# EAGLE design HD44780_to_1.8TFT_adapter.v1 (EAGLE 5.07)
LICENSE: CC-0; PROJECT: HD44780 to 1.8" TFT LCD Adapter
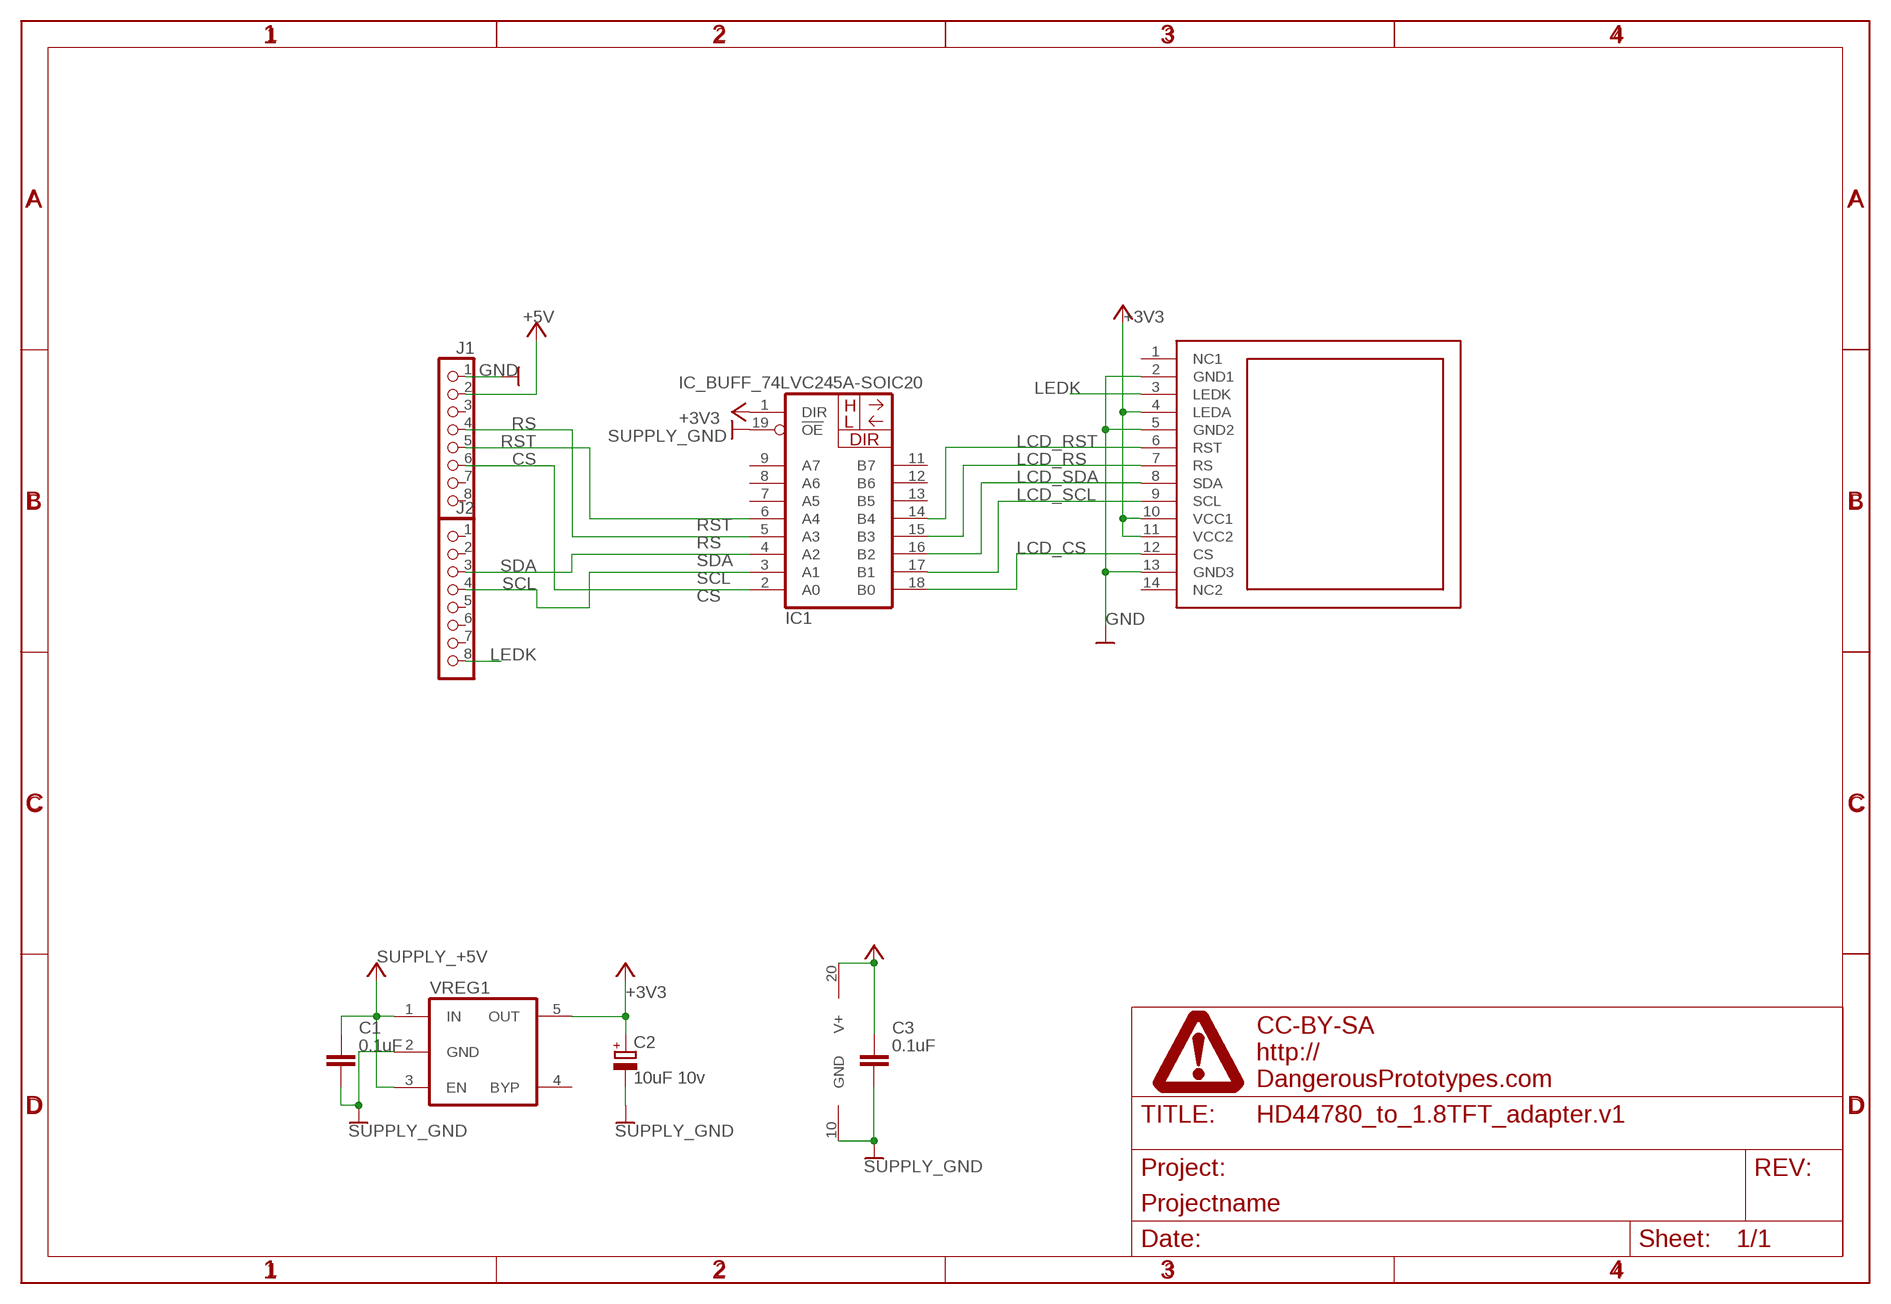
[diagram p0: schematic, sheet 1]

## Parts
C1  0.1uF  CAPACITOR_NPOL-0603  [C603]
C2  10uF 10v  CAPACITOR_POL-SMC_A  [SMC_A]
C3  0.1uF  CAPACITOR_NPOL-0603  [C603]
IC1  IC_BUFF_74LVC245A-SOIC20  [SOIC-20]
J1  CON_HEADER_1X08-PTH  [M1X8]
J2  CON_HEADER_1X08-PTH  [M1X8]
U$1  FRAME_DINA4_L  [DP_LOGO]
U$2  DISP_TFT18  [TFT18]
VREG1  VREG_5PINS-SOT-23-5  [SOT-23-5]

## Nets
+3V3: C2.+ C3.1 IC1.1(DIR) IC1.20(V+) U$2.4(LEDA) U$2.10(VCC1) U$2.11(VCC2) VREG1.5(OUT) ; supply symbol labelled SUPPLY_+3V3
+5V: C1.1 J1.2 VREG1.1(IN) VREG1.3(EN) ; supply symbol labelled SUPPLY_+5V
CS: IC1.2(A0) J1.6
GND: C1.2 C2.- C3.2 IC1.10(GND) IC1.19(!OE) J1.1 U$2.2(GND1) U$2.5(GND2) U$2.13(GND3) VREG1.2(GND) ; supply symbol labelled SUPPLY_GND
LCD_CS: IC1.18(B0) U$2.12(CS)
LCD_RS: IC1.15(B3) U$2.7(RS)
LCD_RST: IC1.14(B4) U$2.6(RST)
LCD_SCL: IC1.17(B1) U$2.9(SCL)
LCD_SDA: IC1.16(B2) U$2.8(SDA)
LEDK: J2.8 U$2.3(LEDK)
RS: IC1.5(A3) J1.4
RST: IC1.6(A4) J1.5
SCL: IC1.3(A1) J2.4
SDA: IC1.4(A2) J2.3
Unconnected: IC1.7(A5) IC1.8(A6) IC1.9(A7) IC1.11(B7) IC1.12(B6) IC1.13(B5) J1.3 J1.7 J1.8 J2.1 J2.2 J2.5 J2.6 J2.7 U$2.1(NC1) U$2.14(NC2) VREG1.4(BYP)

## Library data of the parts
C1 C3 = dp_devices:CAPACITOR_NPOL: Non-Polarized capacitor in various packages
C2 = dp_devices:CAPACITOR_POL: Polarized capacitor in various packages
IC1 = dp_devices:IC_BUFF_74LVC245A: Octal Bus transceiver with 3-state, 3.3V supply
J1 J2 = dp_devices:CON_HEADER_1X08
U$1 = dp_devices:FRAME_DINA4_L: A4 DP frame Standard Dangerous Prototypes schematic frame. Automagically adds the DP logo and standard texts to the PCB Use the atrribute in the schematic editor to change the fields.; FF1: fulfillment by; FF2: Seeed Studio; FF3: www.seeedstudio.com; LICENSE: CC-BY-SA; PROJECT: Projectname; URL1: http://; URL2: DangerousPrototypes.com
U$2 = dp_devices:DISP_TFT18
VREG1 = dp_devices:VREG_5PINS: 5 pins voltage regulator

## Board
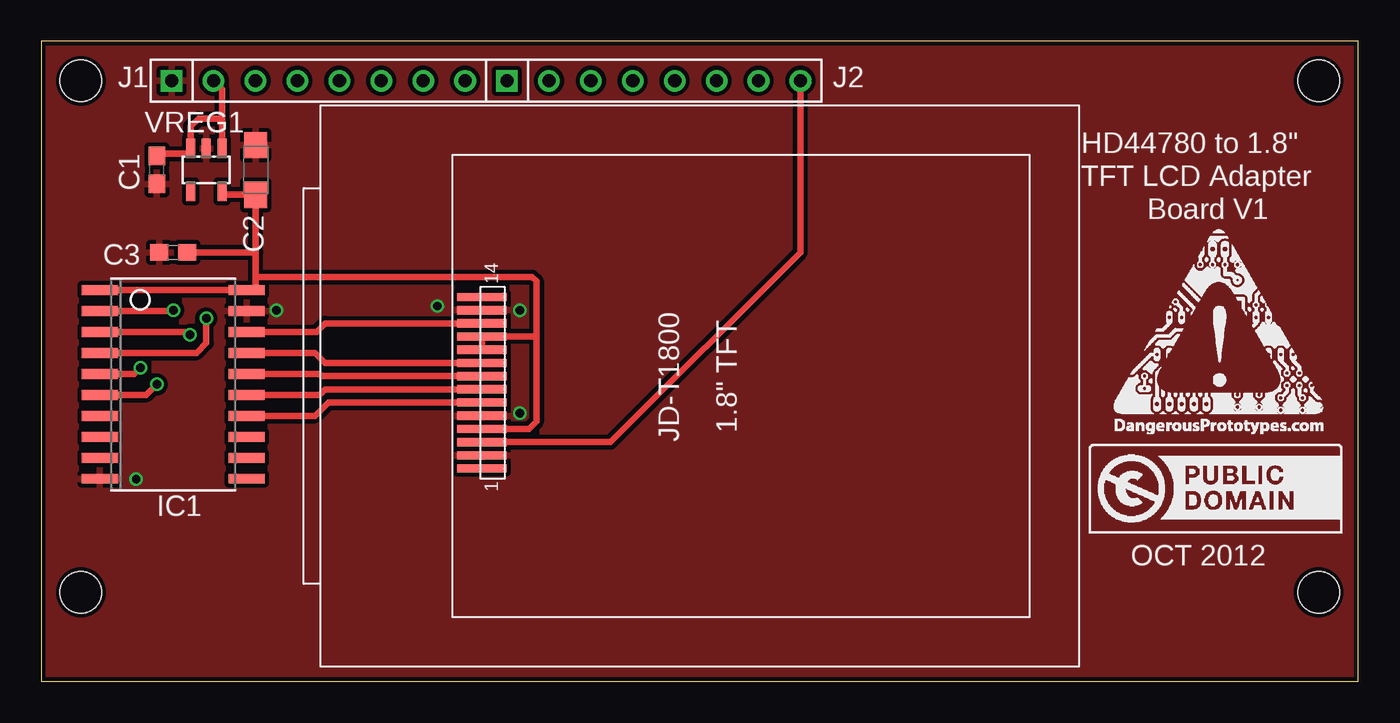
[diagram p1: board, top side]
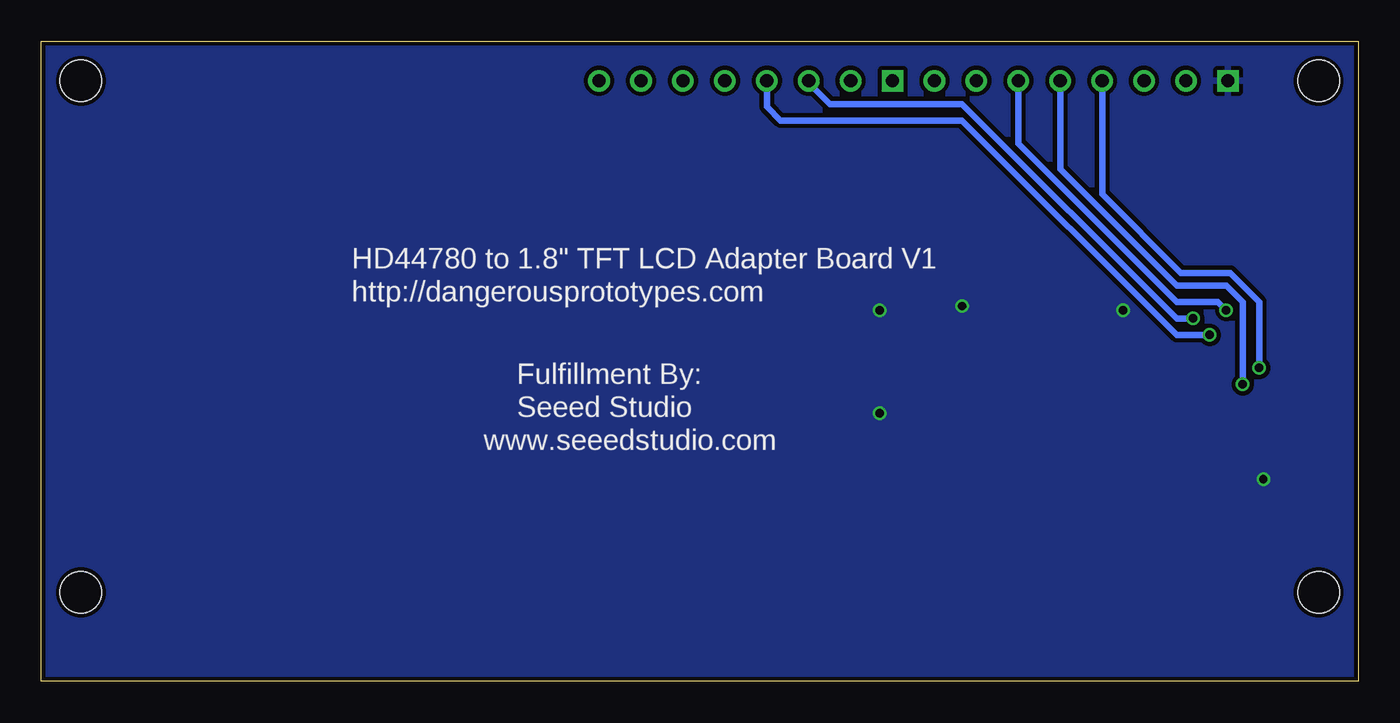
[diagram p2: board, bottom side, seen from below]

Size 79.8 x 38.8 mm. Coordinates in mm from the lower left corner, seen from the top.
Outline: 0,0 79.8,0 79.8,38.8 0,38.8 0,0
Copper layers (1*16): Top 0.035mm / dielectric 1.5mm / Bottom 0.035mm
Design rules "Fusion_eagle_rule_v1.1": minimum track width 6mil, minimum drill 12mil, track to track 6mil, track to pad 6mil, pad to pad 6mil, via to via 6mil, smd to smd 0mil, copper to edge 10mil, drill to drill 10mil, minimum pad ring 10mil, minimum via ring 6mil, stop-mask expansion 2mil, vias tented up to drill 100mil, thermal gap 10mil
Holes 2.5 mm at 2.4,36.4 77.4,36.4 77.4,5.4 2.4,5.4

### Footprints (pad centres in the part's own frame; a part is rotated, then mirrored left to right if it is on the bottom)
C603 = smd 1.1 x 1: 1 -0.85,0; 2 0.85,0
SMC_A = smd 1.6 x 1.4: + -1.5,0; - 1.5,0
SOIC-20 = smd 0.6 x 2.2: 1 -5.715,-4.445; 2 -4.445,-4.445; 3 -3.175,-4.445; 4 -1.905,-4.445; 5 -0.635,-4.445; 6 0.635,-4.445; 7 1.905,-4.445; 8 3.175,-4.445; 9 4.445,-4.445; 10 5.715,-4.445; 11 5.715,4.445; 12 4.445,4.445; 13 3.175,4.445; 14 1.905,4.445; 15 0.635,4.445; 16 -0.635,4.445; 17 -1.905,4.445; 18 -3.175,4.445; 19 -4.445,4.445; 20 -5.715,4.445
M1X8 = drill 0.8 square: 1 -8.89,0 | drill 0.8 round: 2 -6.35,0; 3 -3.81,0; 4 -1.27,0; 5 1.27,0; 6 3.81,0; 7 6.35,0; 8 8.89,0
TFT18 = smd 3 x 0.5: 1 13.2,5; 2 13.2,4.2; 3 13.2,3.4; 4 13.2,2.6; 5 13.2,1.8; 6 13.2,1; 7 13.2,0.2; 8 13.2,-0.6; 9 13.2,-1.4; 10 13.2,-2.2; 11 13.2,-3; 12 13.2,-3.8; 13 13.2,-4.6; 14 13.2,-5.4
SOT-23-5 = smd 0.55 x 1.2: 1 -0.95,-1.3; 2 0,-1.3; 3 0.95,-1.3; 4 0.95,1.3; 5 -0.95,1.3

### Placement (x,y rotation side)
C1  7,31 270 top
C2  13,31 90 top
C3  8,26 180 top
IC1  8,18 270 top
J1  16.79,36.4 0 top
J2  37.11,36.4 0 top
U$1  1.87,-5.63 0 top  (outside the outline)
U$2  39.9,17.9 180 top
U$3  [LOGO_CC-0]  63.5,9 0 top
U$4  [DP_LOGO_ART_0.5X0.5]  65,15 0 top
VREG1  10,31 180 top

### Tracks (layer width: path | path; a pad name or v marks a point on that pad's centre or on a via)
+3V3
  Top 0.406: VREG1.5 10.95,29.55 11,29.5 C2.+ 13,26 | U$2.10 U$2.11 29.9,20.9 30,21 | U$2.4 29.55,15.3 30,15.75 30,21 | 30,21 30,24.25 29.75,24.5 13,24.5 | 13,24.5 13,23.75 12.48,23.75 IC1.20 IC1.1 | 13,24.5 13,26 | 13,26 C3.1
+5V
  Top 0.406: 10.95,34.11 VREG1.1 | 10.95,34.11 10.95,35.89 J1.2 | 10.95,34.11 9.53,34.11 9.05,33.64 VREG1.3 9.05,32.05 9,32 7.15,32 C1.1 7,32
CS  (via drill 0.51)
  Top 0.406: IC1.2 7.95,22.45 v8,22.5
  Bottom 0.406: J1.6 20.6,32.6 11,23 8.5,23 v8,22.5
GND  (via drill 0.51)
  other vias: 29,22.5 24,22.75 29,16.25 14.25,22.5 5.75,12.25
  pour Bottom (isolate 0.254, rank 6): 0,39 80,39 80,0 0,0
  pour Top (isolate 0.254, rank 6): 0,39 80,39 80,0 0,0
LCD_CS
  Top 0.406: U$2.12 17.2,21.7 16.68,21.18 IC1.18
LCD_RS
  Top 0.406: U$2.7 17.2,17.7 16.86,17.37 IC1.15
LCD_RST
  Top 0.406: U$2.6 17.4,16.9 16.59,16.09 IC1.14
LCD_SCL
  Top 0.406: U$2.9 17.2,19.3 16.59,19.91 IC1.17
LCD_SDA
  Top 0.406: U$2.8 17,18.5 16.86,18.63 IC1.16
LEDK
  Top 0.406: U$2.3 34.5,14.5 46,26 J2.8
RS  (via drill 0.51)
  Top 0.406: IC1.5 5.63,18.63 v6,19
  Bottom 0.406: v6,19 6,23 7.75,24.75 10.75,24.75 15.52,29.52 J1.4
RST  (via drill 0.51)
  Top 0.406: IC1.6 6.37,17.37 v7,18
  Bottom 0.406: v7,18 7,23 8,24 11,24 18.06,31.06 J1.5
SCL  (via drill 0.51)
  Top 0.406: IC1.3 8.82,21.18 v9,21
  Bottom 0.406: J2.4 35.84,34.84 35,34 24,34 11,21 v9,21
SDA  (via drill 0.51)
  Top 0.406: IC1.4 9.4,19.91 10,20.5 v10,22
  Bottom 0.406: J2.3 33.3,36.3 32,35 24,35 11,22 v10,22

### Text on the board
tNames: HD44780 to 1.8" | TFT LCD Adapter | Board V1 | OCT 2012
bNames: HD44780 to 1.8" TFT LCD Adapter Board V1 | http://dangerousprototypes.com | Fulfillment By: | Seeed Studio | www.seeedstudio.com